# EAGLE design Synth_SCG_HAT (EAGLE 9.6.2)
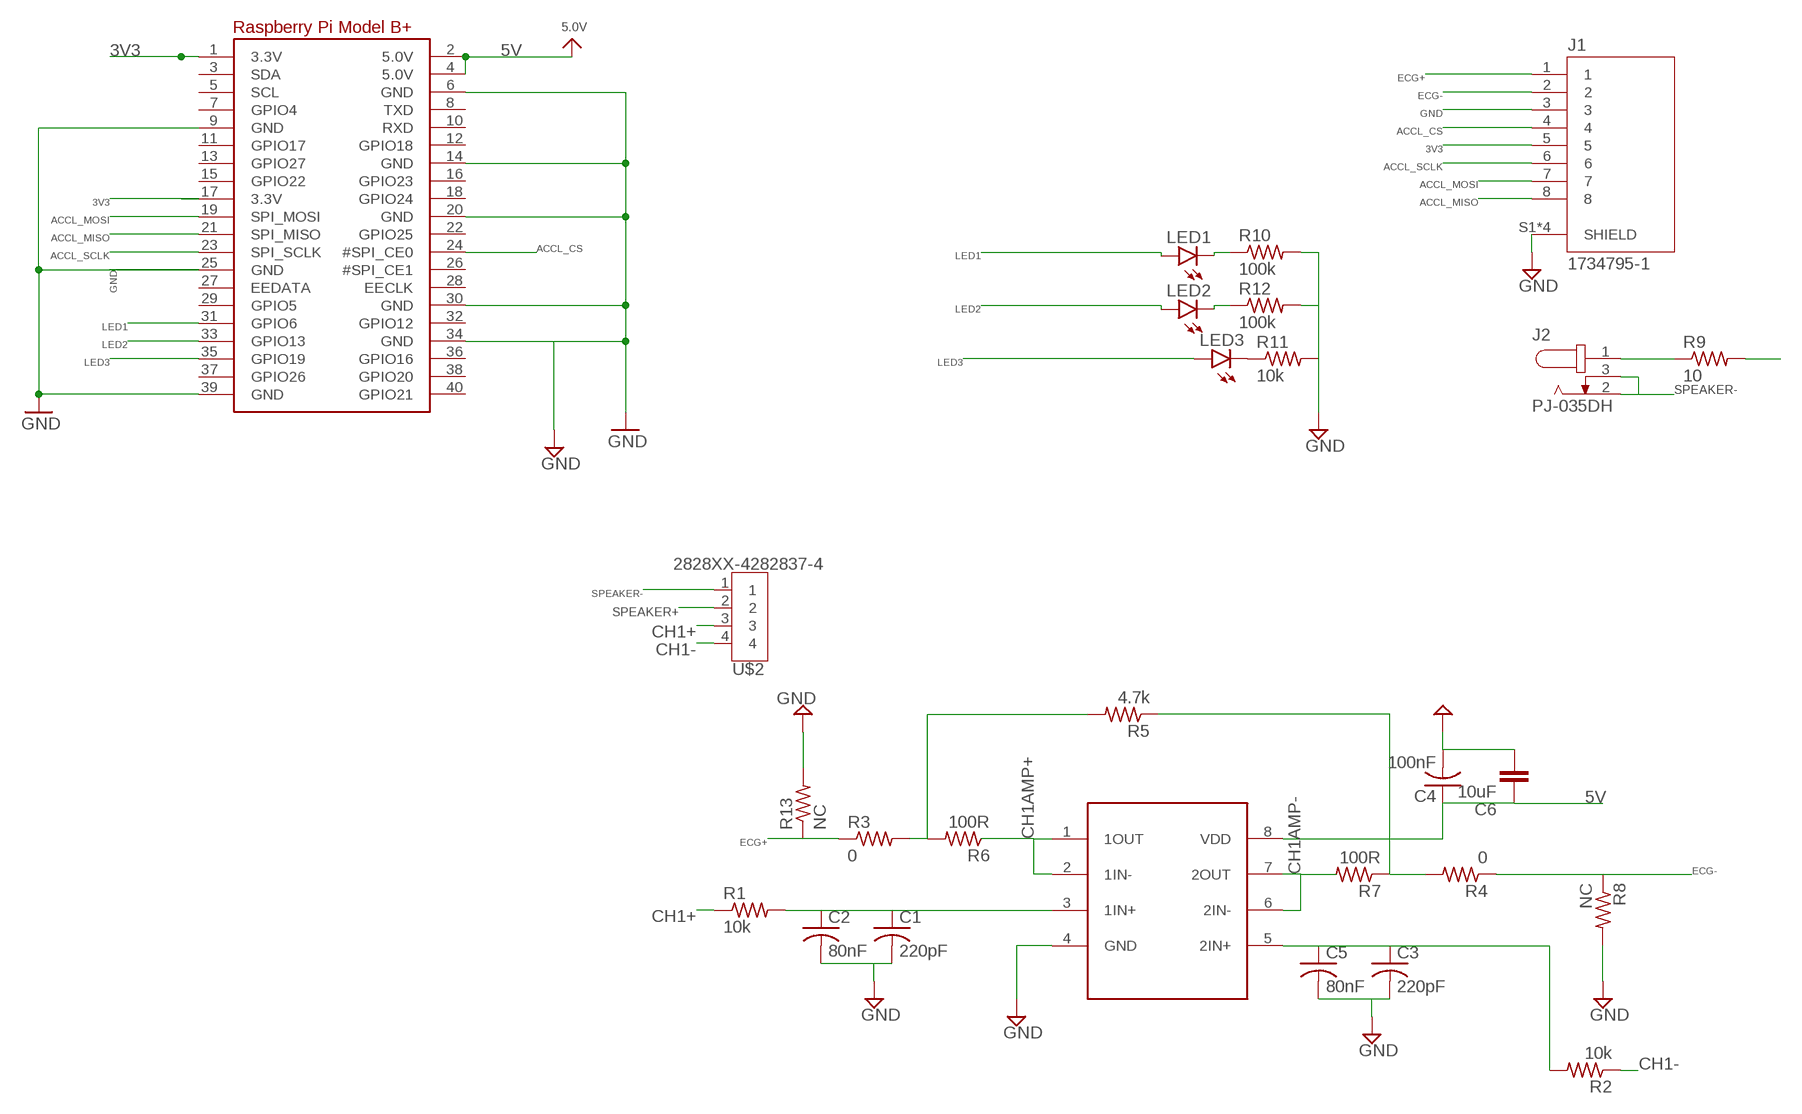
[diagram p0: schematic, sheet 1]

## Parts
C1  220pF  C-US_CHIP-1206(3216-METRIC)  [CAPC3216X135]
C2  80nF  C-US_CHIP-0805(2012-METRIC)  [CAPC2012X110]
C3  220pF  C-US_CHIP-1206(3216-METRIC)  [CAPC3216X135]
C4  100nF  C-US_CHIP-0603(1608-METRIC)  [CAPC1608X85]
C5  80nF  C-US_CHIP-0805(2012-METRIC)  [CAPC2012X110]
C6  10uF  C_TANTALUM-1206(3216-METRIC)  [CAPM3216X180]
J1  1734795-1  [TE_1734795-1]
J2  PJ-035DH  [CUI_PJ-035DH]
LED1  LEDCHIPLED_1206  [CHIPLED_1206]
LED2  LEDCHIPLED_1206  [CHIPLED_1206]
LED3  LEDCHIPLED_1206  [CHIPLED_1206]
R1  10k  R-US_R0603  [R0603]
R2  10k  R-US_R0603  [R0603]
R3  0  R-US_R0603  [R0603]
R4  0  R-US_R0603  [R0603]
R5  4.7k  R-US_R0603  [R0603]
R6  100R  R-US_R0603  [R0603]
R7  100R  R-US_R0603  [R0603]
R8  NC  R-US_R0603  [R0603]
R9  10  R-US_R0603  [R0603]
R10  100k  R-US_R0603  [R0603]
R11  10k  R-US_R0603  [R0603]
R12  100k  R-US_R0603  [R0603]
R13  NC  R-US_R0603  [R0603]
RPI1  RASPBERRYPI_BPLUS_BONNETNODIM  [PI_BONNET_NODIM]
U$1  TLV4112  [DIP794W45P254L959H508Q8]
U$2  2828XX-4282837-4  [TERMBLK_508-4N]

## Nets
3.3V@1: RPI1.17(3.3V)
3V3: J1.5 RPI1.1(3.3V)
5V: C4.1 C6.1 RPI1.2(5.0V) RPI1.4(5.0V) U$1.8(VDD) ; supply symbol labelled 5.0V
ACCL_CS: J1.4 RPI1.24(#SPI_CE0)
ACCL_MISO: J1.8 RPI1.21(SPI_MISO)
ACCL_MOSI: J1.7 RPI1.19(SPI_MOSI)
ACCL_SCLK: J1.6 RPI1.23(SPI_SCLK)
CH1+: R1.1 U$2.3
CH1-: R2.1 U$2.4
CH1AMP+: R6.1 U$1.1(1OUT) U$1.2(1IN-)
CH1AMP-: R7.2 U$1.6(2IN-) U$1.7(2OUT)
ECG+: J1.1 R3.1 R13.1
ECG-: J1.2 R4.1 R8.1
GND: C1.2 C2.2 C3.2 C4.2 C5.2 C6.2 J1.3 J1.S1(SHIELD) J1.S2(SHIELD) J1.S3(SHIELD) J1.S4(SHIELD) R8.2 R10.2 R11.2 R12.2 R13.2 RPI1.6(GND) RPI1.9(GND) RPI1.14(GND) RPI1.20(GND) RPI1.25(GND) RPI1.30(GND) RPI1.34(GND) RPI1.39(GND) U$1.4(GND)
LED1: LED1.A RPI1.31(GPIO6)
LED2: LED2.A RPI1.33(GPIO13)
LED3: LED3.A RPI1.35(GPIO19)
N$1: C1.1 C2.1 R1.2 U$1.3(1IN+)
N$2: R3.2 R5.2 R6.2
N$3: C3.1 C5.1 R2.2 U$1.5(2IN+)
N$4: J2.1 R9.1
N$5: R4.2 R5.1 R7.1
N$9: LED3.C R11.1
N$11: LED2.C R12.1
N$14: LED1.C R10.1
SPEAKER+: R9.2 U$2.2
SPEAKER-: J2.2 J2.3 U$2.1
Unconnected: RPI1.3(SDA) RPI1.5(SCL) RPI1.7(GPIO4) RPI1.8(TXD) RPI1.10(RXD) RPI1.11(GPIO17) RPI1.12(GPIO18) RPI1.13(GPIO27) RPI1.15(GPIO22) RPI1.16(GPIO23) RPI1.18(GPIO24) RPI1.22(GPIO25) RPI1.26(#SPI_CE1) RPI1.27(EEDATA) RPI1.28(EECLK) RPI1.29(GPIO5) RPI1.32(GPIO12) RPI1.36(GPIO16) RPI1.37(GPIO26) RPI1.38(GPIO20) RPI1.40(GPIO21)

## Library data of the parts
C1-C5 = Capacitor:C-US: Capacitor - ANSI; CATEGORY: Capacitor
C6 = Capacitor:C: Capacitor - Generic; CATEGORY: Capacitor
J1 = SamacSys_Parts:1734795-1: RJ45,8P8C,SHD,W/O LED,DIP 6u" Check prices <https://pricing.snapeda.com/parts/1734795-1/TE%20Connectivity/view-part?ref=eda>; AVAILABILITY: In Stock; CENTERLINE_PITCH: 1.02 mm[.04 in]; COMMENT: 1734795-1; DESCRIPTION: RJ45,8P8C,SHD,W/O LED,DIP 6u; EU_ROHS_COMPLIANCE: Compliant; MF: TE Connectivity; MP: 1734795-1; NUMBER_OF_POSITIONS: 8; PACKAGE: None; PRICE: None; PURCHASE-URL: https://pricing.snapeda.com/search/part/1734795-1/?ref=eda
J2 = SamacSys_Parts:PJ-035DH: 1.3 mm Center Pin, 3.5 A, Right Angle, Through Hole, Dc Power Jack Connector Check prices <https://pricing.snapeda.com/parts/PJ-035DH/CUI%20Devices/view-part?ref=eda>; AVAILABILITY: Warning; CUI_PURCHASE_URL: https://www.cuidevices.com/product/interconnect/connectors/dc-power-connectors/jacks/pj-035dh?utm_source=snapeda.com&utm_medium=referral&utm_campaign=snapedaBOM; DESCRIPTION: 1.3 x 3.8 mm, 3.5 A, Horizontal, Through Hole, Dc Power Jack Connector; MF: CUI Devices; MP: PJ-035DH; PACKAGE: None; PRICE: None; PURCHASE-URL: https://pricing.snapeda.com/search/part/PJ-035DH/?ref=eda
LED1-LED3 = led:LED: LED OSRAM: - CHIPLED LG R971, LG N971, LY N971, LG Q971, LY Q971, LO R971, LY R971 LH N974, LH R974 LS Q976, LO Q976, LY Q976 LO Q996 - Hyper CHIPLED LW Q18S LB Q993, LB Q99A, LB R99A - SideLED LS A670, LO A670, LY A670, LG A670, LP A670 LB A673, LV A673, LT A673, LW A673 LH A674 LY A675 LS A676, LA A676, LO A676, LY A676, LW A676 LS A679, LY A679, LG A679 - Hyper Micro SIDELED® LS Y876, LA Y876, LO Y876, LY Y876 LT Y87S - SmartLED LW L88C, LW L88S LB L89C, LB L89S, LG L890 LS L89K, LO L89K, LY L89K LS L896, LA L896, LO L896, LY L896 - TOPLED LS T670, LO T670, LY T670, LG T670, LP T670 LSG T670, LSP T670, LSY T670, LOP T670, LYG T670 LG T671, LOG T671, LSG T671 LB T673, LV T673, LT T673, LW T673 LH T674 LS T676, LA T676, LO T676, LY T676, LB T676, LH T676, LSB T676, LW T676 LB T67C, LV T67C, LT T67C, LS T67K, LO T67K, LY T67K, LW E67C LS E67B, LA E67B, LO E67B, LY E67B, LB E67C, LV E67C, LT E67C LW T67C LS T679, LY T679, LG T679 LS T770, LO T770, LY T770, LG T770, LP T770 LB T773, LV T773, LT T773, LW T773 LH T774 LS E675, LA E675, LY E675, LS T675 LS T776, LA T776, LO T776, LY T776, LB T776 LHGB T686 LT T68C, LB T68C - Hyper Mini TOPLED® LB M676 - Mini TOPLED Santana® LG M470 LS M47K, LO M47K, LY M47K Source: http://www.osram.convergy.de LUXEON: - LUMILED® LXK2-PW12-R00, LXK2-PW12-S00, LXK2-PW14-U00, LXK2-PW14-V00 LXK2-PM12-R00, LXK2-PM12-S00, LXK2-PM14-U00 LXK2-PE12-Q00, LXK2-PE12-R00, LXK2-PE12-S00, LXK2-PE14-T00, LXK2-PE14-U00 LXK2-PB12-K00, LXK2-PB12-L00, LXK2-PB12-M00, LXK2-PB14-N00, LXK2-PB14-P00, LXK2-PB14-Q00 LXK2-PR12-L00, LXK2-PR12-M00, LXK2-PR14-Q00, LXK2-PR14-R00 LXK2-PD12-Q00, LXK2-PD12-R00, LXK2-PD12-S00 LXK2-PH12-R00, LXK2-PH12-S00 LXK2-PL12-P00, LXK2-PL12-Q00, LXK2-PL12-R00 Source: www.luxeon.com KINGBRIGHT: KA-3528ASYC Source: www.kingbright.com
R1-R13 = resistor:R-US_: RESISTOR, American symbol
RPI1 = microbuilder:RASPBERRYPI_BPLUS
U$1 = SamacSys_Parts:TLV4112
U$2 = Connector:2828XX-4: 4 Position Wire to Board Terminal Block Horizontal with Board Datasheet <https://www.te.com.cn/commerce/DocumentDelivery/DDEController?Action=showdoc&DocId=Catalog+Section%7F1308389_EUROSTYLE_TERMINAL_BLOCKS%7F0607%7Fpdf%7FEnglish%7FENG_CS_1308389_EUROSTYLE_TERMINAL_BLOCKS_0607.pdf%7F2-282837-5>; CATEGORY: Connector; DESCRIPTION: TERM BLK 4P SIDE ENT 5.08mm PCB; MANUFACTURER: TE Connectivity; MPN: 282837-4; OPERATING_TEMPERATURE: 40°C to +105°C; PART_STATUS: Active; ROHS_COMPLIANCE: RoHS Compliant; SERIES: 283737; SUBCATEGORY: Terminal Block; TYPE: Side Wire Entry

## Board
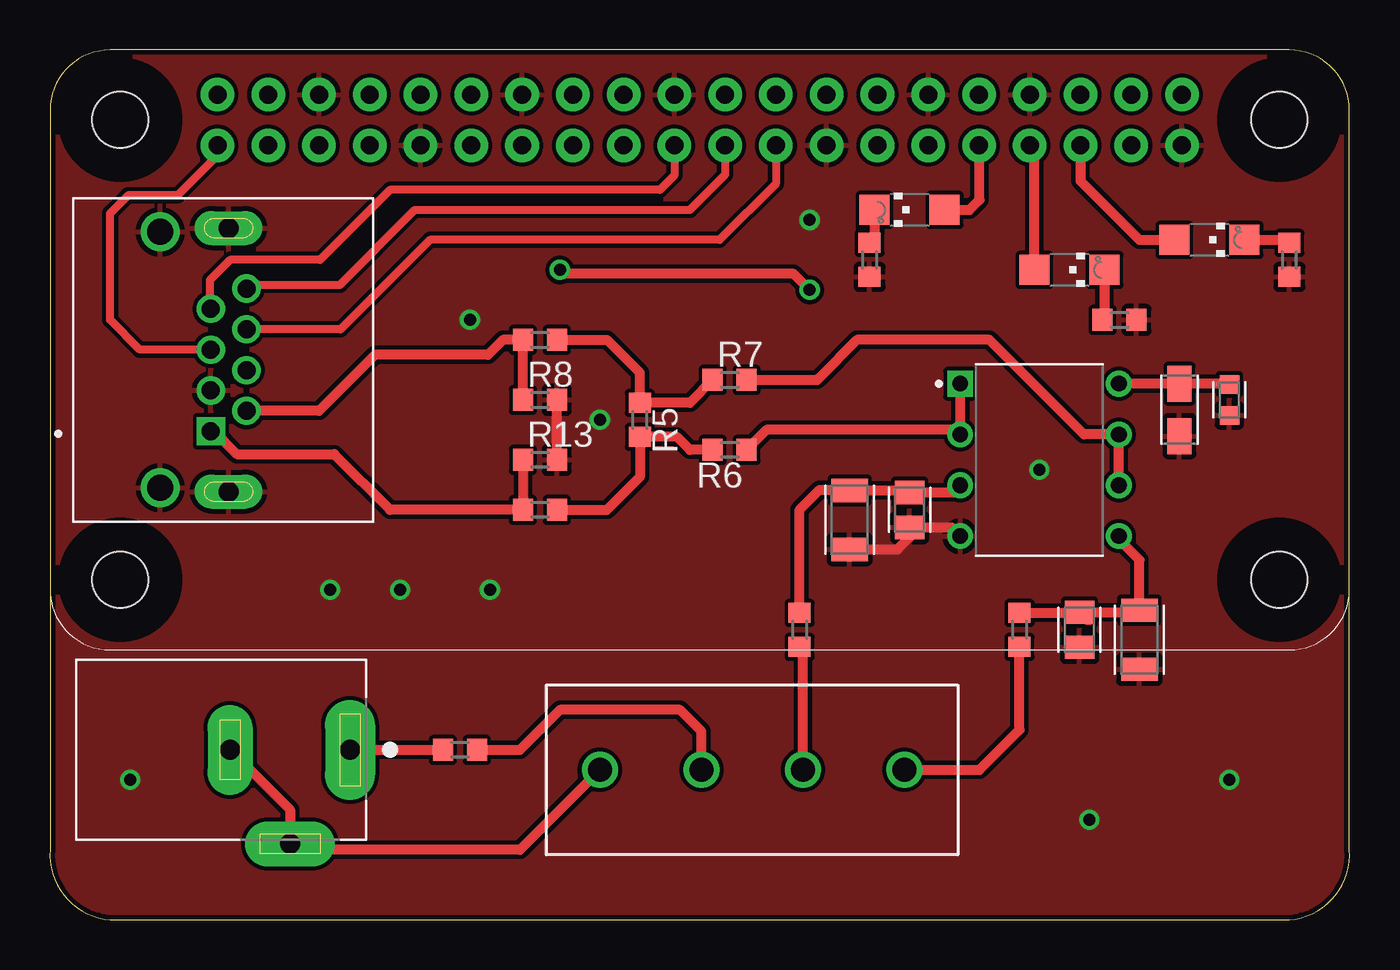
[diagram p1: board, top side]
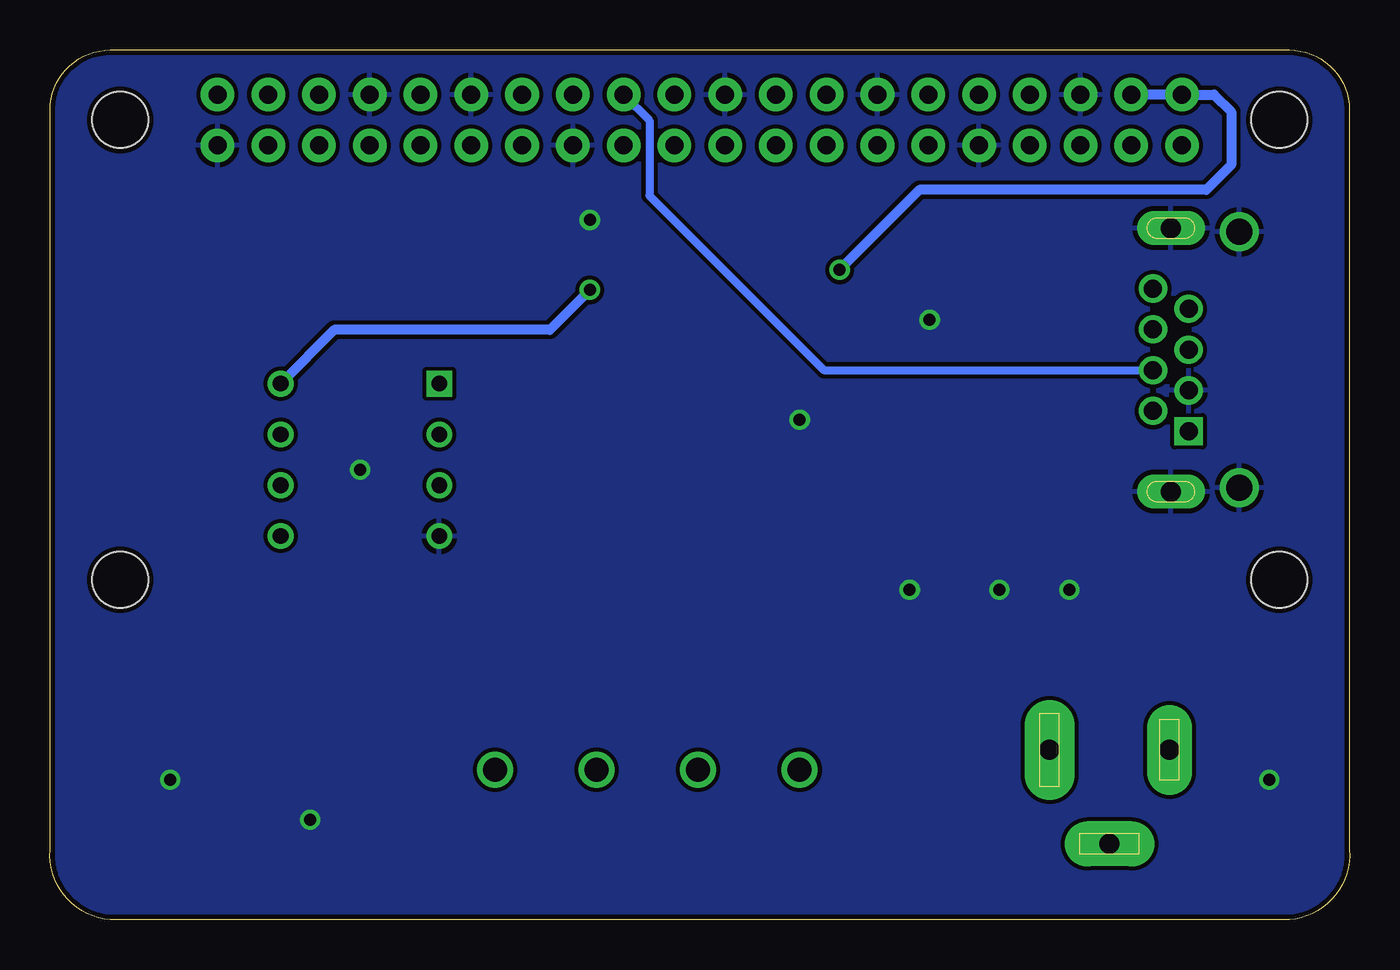
[diagram p2: board, bottom side, seen from below]

Size 65.02 x 43.5 mm. Coordinates in mm from the lower left corner, seen from the top.
Outline: 3.01,0 62.01,0 arc90 65.01,3.5 65.01,40.5 arc90 62.01,43.5 3.01,43.5 arc90 0.01,40.5 0.01,3.5 arc90 3.01,0
Copper layers (1*16): Top 0.035mm / dielectric 1.5mm / Bottom 0.035mm
Design rules "adafruit": minimum track width 8mil, minimum drill 15.5mil, track to track 8mil, track to pad 8mil, pad to pad 8mil, via to via 8mil, smd to smd 8mil, copper to edge 10mil, drill to drill 8mil, minimum pad ring 10mil, minimum via ring 8mil, stop-mask expansion 2mil, vias tented up to drill 20mil, thermal gap 10mil

### Footprints (pad centres in the part's own frame; a part is rotated, then mirrored left to right if it is on the bottom)
CAPC3216X135 = smd 1.165 x 1.815: 1 -1.475,0; 2 1.475,0
CAPC2012X110 = smd 1.165 x 1.465: 1 -0.875,0; 2 0.875,0
CAPC1608X85 = smd 0.921 x 0.97: 1 -0.775,0; 2 0.775,0
CAPM3216X180 = smd 1.796 x 1.189: 1 -1.31,0; 2 1.31,0
TE_1734795-1 = drill 0.9 square: 1 3.57,2.54 | drill 0.9: 2 2.55,4.32; 3 1.53,2.54; 4 0.51,4.32; 5 -0.51,2.54; 6 -1.53,4.32; 7 -2.55,2.54; 8 -3.57,4.32 | drill 1 pad 1.7 long: S1 -6.59,3.43; S2 6.59,3.43 | drill 1.3: S3 -6.4,0; S4 6.4,0
CUI_PJ-035DH = drill 1 pad 2.5 long: 1 0,0 | drill 1 pad 2.25 long: 2 6,0; 3 3,4.7
CHIPLED_1206 = smd 1.5 x 1.5: A 0,-1.75; C 0,1.75
R0603 = smd 1 x 1.1: 1 -0.85,0; 2 0.85,0
PI_BONNET_NODIM = drill 0.9 pad 1.676: 1 8.37,25.23; 2 8.37,27.77; 3 10.91,25.23; 4 10.91,27.77; 5 13.45,25.23; 6 13.45,27.77; 7 15.99,25.23; 8 15.99,27.77; 9 18.53,25.23; 10 18.53,27.77; 11 21.07,25.23; 12 21.07,27.77; 13 23.61,25.23; 14 23.61,27.77; 15 26.15,25.23; 16 26.15,27.77; 17 28.69,25.23; 18 28.69,27.77; 19 31.23,25.23; 20 31.23,27.77; 21 33.77,25.23; 22 33.77,27.77; 23 36.31,25.23; 24 36.31,27.77; 25 38.85,25.23; 26 38.85,27.77; 27 41.39,25.23; 28 41.39,27.77; 29 43.93,25.23; 30 43.93,27.77; 31 46.47,25.23; 32 46.47,27.77; 33 49.01,25.23; 34 49.01,27.77; 35 51.55,25.23; 36 51.55,27.77; 37 54.09,25.23; 38 54.09,27.77; 39 56.63,25.23; 40 56.63,27.77 | hole 2.8: 3.5,3.5; 3.5,26.5; 61.5,26.5; 61.5,3.5
DIP794W45P254L959H508Q8 = drill 0.78 pad 1.13 square: 1 -3.97,3.81 | drill 0.78 pad 1.13: 2 -3.97,1.27; 3 -3.97,-1.27; 4 -3.97,-3.81; 5 3.97,-3.81; 6 3.97,-1.27; 7 3.97,1.27; 8 3.97,3.81
TERMBLK_508-4N = drill 1.2: 1 0,0; 2 5.08,0; 3 10.16,0; 4 15.24,0

### Placement (x,y rotation side)
C1  40.01,20 270 top
C2  43.01,20.5 270 top
C3  54.51,14 270 top
C4  59.01,26 270 top
C5  51.51,14.5 270 top
C6  56.51,25.5 270 top
J1  5.51,28 270 top
J2  15.01,8.5 180 top
LED1  43.01,35.5 90 top
LED2  51.01,32.5 270 top
LED3  58.01,34 270 top
R1  37.51,14.5 90 top
R2  48.51,14.5 90 top
R3  24.51,20.5 0 top
R4  24.51,29 0 top
R5  29.51,25 270 top
R6  34.01,23.5 180 top
R7  34.01,27 0 top
R8  24.51,26 0 top
R9  20.51,8.5 0 top
R10  41.01,33 270 top
R11  62.01,33 270 top
R12  53.51,30 0 top
R13  24.51,23 0 top
RPI1  0.01,13.5 0 top
U$1  49.51,23 0 top
U$2  27.51,7.5 0 top

### Tracks (layer width: path | path; a pad name or v marks a point on that pad's centre or on a via)
3V3
  Top 0.406: J1.5 4.5,28.51 3.01,30 3.01,35.33 3.91,36.23 6.38,36.23 8.38,38.23 RPI1.1
5V  (via drill 0.6 pad 0.55)
  Top 0.508: C6.1 | C6.1 U$1.8 | C4.1 58.97,26.81 C6.1 | v25.51,32.5 25.7,32.31 37.2,32.31 v38.01,31.5
  Bottom 0.508: RPI1.4 RPI1.2 6.78,41.27 5.92,40.41 5.92,37.75 7.17,36.5 21.51,36.5 v25.51,32.5 | v38.01,31.5 40.01,29.5 50.79,29.5 U$1.8
ACCL_CS
  Bottom 0.406: RPI1.24 35.02,39.98 35.02,36.21 26.3,27.49 J1.4
ACCL_MISO
  Top 0.406: RPI1.21 33.78,37.27 32.01,35.5 18.25,35.5 14.51,31.76 10.02,31.76 J1.8
ACCL_MOSI
  Top 0.406: RPI1.19 31.24,37.23 30.51,36.5 17.01,36.5 13.51,33 9.01,33 8.01,32 8.01,30.59 J1.7
ACCL_SCLK
  Top 0.406: RPI1.23 36.32,36.81 33.51,34 19.01,34 14.54,29.53 J1.6
CH1+
  Top 0.508: U$2.3 37.67,13.49 R1.1
CH1-
  Top 0.508: U$2.4 46.51,7.5 48.51,9.5 R2.1
CH1AMP+
  Top 0.508: U$1.1 U$1.2 45.31,24.5 35.86,24.5 R6.1
CH1AMP-
  Top 0.508: U$1.6 U$1.7 51.74,24.27 47.01,29 40.38,29 38.45,27.06 38.38,27 R7.2
ECG+
  Top 0.508: J1.1 8.21,24.43 9.35,23.29 14.22,23.29 17.01,20.5 R3.1 R13.1
ECG-
  Top 0.508: J1.2 13.46,25.45 16.26,28.25 21.91,28.25 22.66,29 R4.1 R8.1
GND  (via drill 0.6 pad 0.55)
  Top 0.508: C1.2 42.41,18.52 43.01,19.12 C2.2 45.1,19.62 U$1.4 | R13.2 R8.2
  other vias: 14.01,16.5 17.51,16.5 22.01,16.5 52.01,5 59.01,7 21.01,30 38.01,35 49.51,22.5 4.01,7 27.51,25
  pour Top: -3.99,46.97 -3.99,-1 76.53,-1 76.53,46.97
  pour Bottom: -3.99,46.97 -3.99,-1 76.03,-1 76.03,46.97
LED1
  Top 0.508: LED1.A 46.01,35.5 46.51,36 46.51,38.7 RPI1.31
LED2
  Top 0.508: LED2.A 49.26,38.49 RPI1.33
LED3
  Top 0.508: RPI1.35 51.56,36.95 54.51,34 LED3.A
N$1
  Top 0.508: C2.1 43.51,21.38 | 43.51,21.38 45.18,21.38 U$1.3 | 43.51,21.38 43.41,21.48 C1.1 39.98,21.5 38.51,21.5 37.51,20.5 R1.2
N$2
  Top 0.508: R6.2 32.01,23.5 31.36,24.15 R5.2 29.51,22.15 27.86,20.5 R3.2
N$3
  Top 0.508: R2.2 51.66,15.35 52.01,15 51.88,15 C5.1 54.41,15.38 C3.1 54.51,18 53.48,19.03 U$1.5
N$4
  Top 0.508: J2.1 R9.1
N$5
  Top 0.508: R7.1 32.01,25.85 R5.1 29.51,27.35 27.86,29 R4.2
N$9
  Top 0.508: LED3.C 61.86,34 R11.1
N$11
  Top 0.508: LED2.C 52.76,30.1 R12.1
N$14
  Top 0.508: LED1.C 41.26,34.1 R10.1
SPEAKER+
  Top 0.508: R9.2 23.51,8.5 25.51,10.5 31.51,10.5 32.59,9.42 U$2.2
SPEAKER-
  Top 0.508: J2.2 12.01,5.5 J2.3 12.31,3.5 23.51,3.5 U$2.1